# EAGLE design AT45DB041ESHNB (EAGLE 9.2.0)
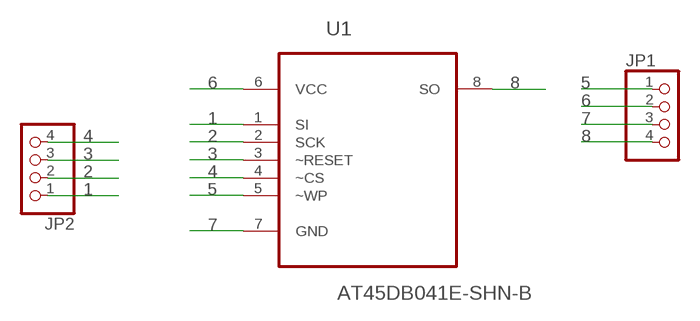
[diagram p0: schematic, sheet 1]

## Parts
JP1  PINHD-1X4  [1X04]
JP2  PINHD-1X4  [1X04]
U1  AT45DB041E-SHN-B  [SOIC127P798X216-8N]

## Nets
1: JP2.1 U1.1(SI)
2: JP2.2 U1.2(SCK)
3: JP2.3 U1.3(~RESET)
4: JP2.4 U1.4(~CS)
5: JP1.1 U1.5(~WP)
6: JP1.2 U1.6(VCC)
7: JP1.3 U1.7(GND)
8: JP1.4 U1.8(SO)

## Library data of the parts
JP1 JP2 = pinhead:PINHD-1X4: PIN HEADER
U1 = AT45DB041E-SHN-B:AT45DB041E-SHN-B: 4-megabit DataFlash; AVAILABILITY: Good; DESCRIPTION: AT45DB041 Series 4 Mb Data Flash 1.65 - 3.6 V 85 Mhz - SOIC-8 _200 mil_; MF: Adesto; MP: AT45DB041E-SHN-B; PACKAGE: SOIC-8 Adesto Technologies; PRICE: 0.93 USD

## Board
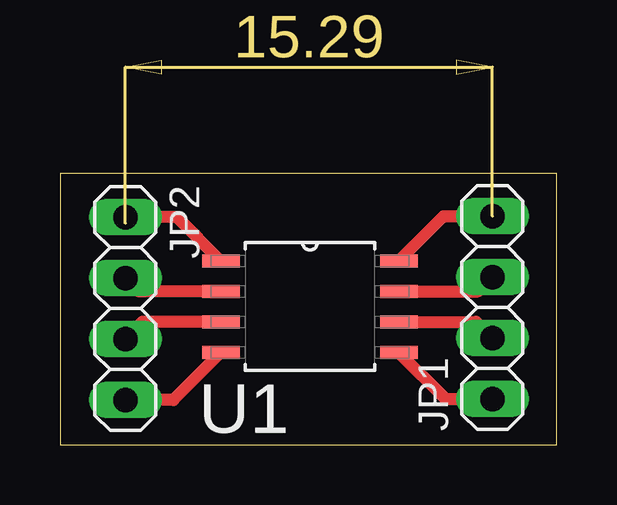
[diagram p1: board, top side]

Size 20.71 x 11.31 mm. Coordinates in mm from the lower left corner, seen from the top.
Outline: 0,0 20.71,0 20.71,11.31 0,11.31 0,0
Copper layers (1*16): Top 0.035mm / dielectric 1.5mm / Bottom 0.035mm
Design rules "default": minimum track width 6mil, minimum drill 0.35mm, track to track 6mil, track to pad 6mil, pad to pad 6mil, via to via 6mil, smd to smd 6mil, copper to edge 40mil, drill to drill 6mil, minimum pad ring 10mil, minimum via ring 8mil, stop-mask expansion 4mil, vias tented up to drill 0mil, thermal gap 10mil

### Footprints (pad centres in the part's own frame; a part is rotated, then mirrored left to right if it is on the bottom)
1X04 = drill 1.016 long: 1 -3.81,0; 2 -1.27,0; 3 1.27,0; 4 3.81,0
SOIC127P798X216-8N = smd 1.549 x 0.533: 1 -3.708,1.905; 2 -3.708,0.635; 3 -3.708,-0.635; 4 -3.708,-1.905; 5 3.708,-1.905; 6 3.708,-0.635; 7 3.708,0.635; 8 3.708,1.905

### Placement (x,y rotation side)
JP1  18.02,5.72 90 top
JP2  2.72,5.68 270 top
U1  10.42,5.76 0 top

### Tracks (layer width: path | path; a pad name or v marks a point on that pad's centre or on a via)
1
  Top 0.508: U1.1 4.88,9.49 JP2.1
2
  Top 0.508: U1.2 3.28,6.39 JP2.2
3
  Top 0.508: U1.3 3.44,5.12 JP2.3
4
  Top 0.508: U1.4 4.72,1.87 JP2.4
5
  Top 0.508: U1.5 16.07,1.91 JP1.1
6
  Top 0.508: U1.6 17.34,5.12 JP1.2
7
  Top 0.508: U1.7 17.42,6.39 JP1.3
8
  Top 0.508: U1.8 15.99,9.53 JP1.4